# EAGLE design wxeda-sd-mod (EAGLE 7.0.0)
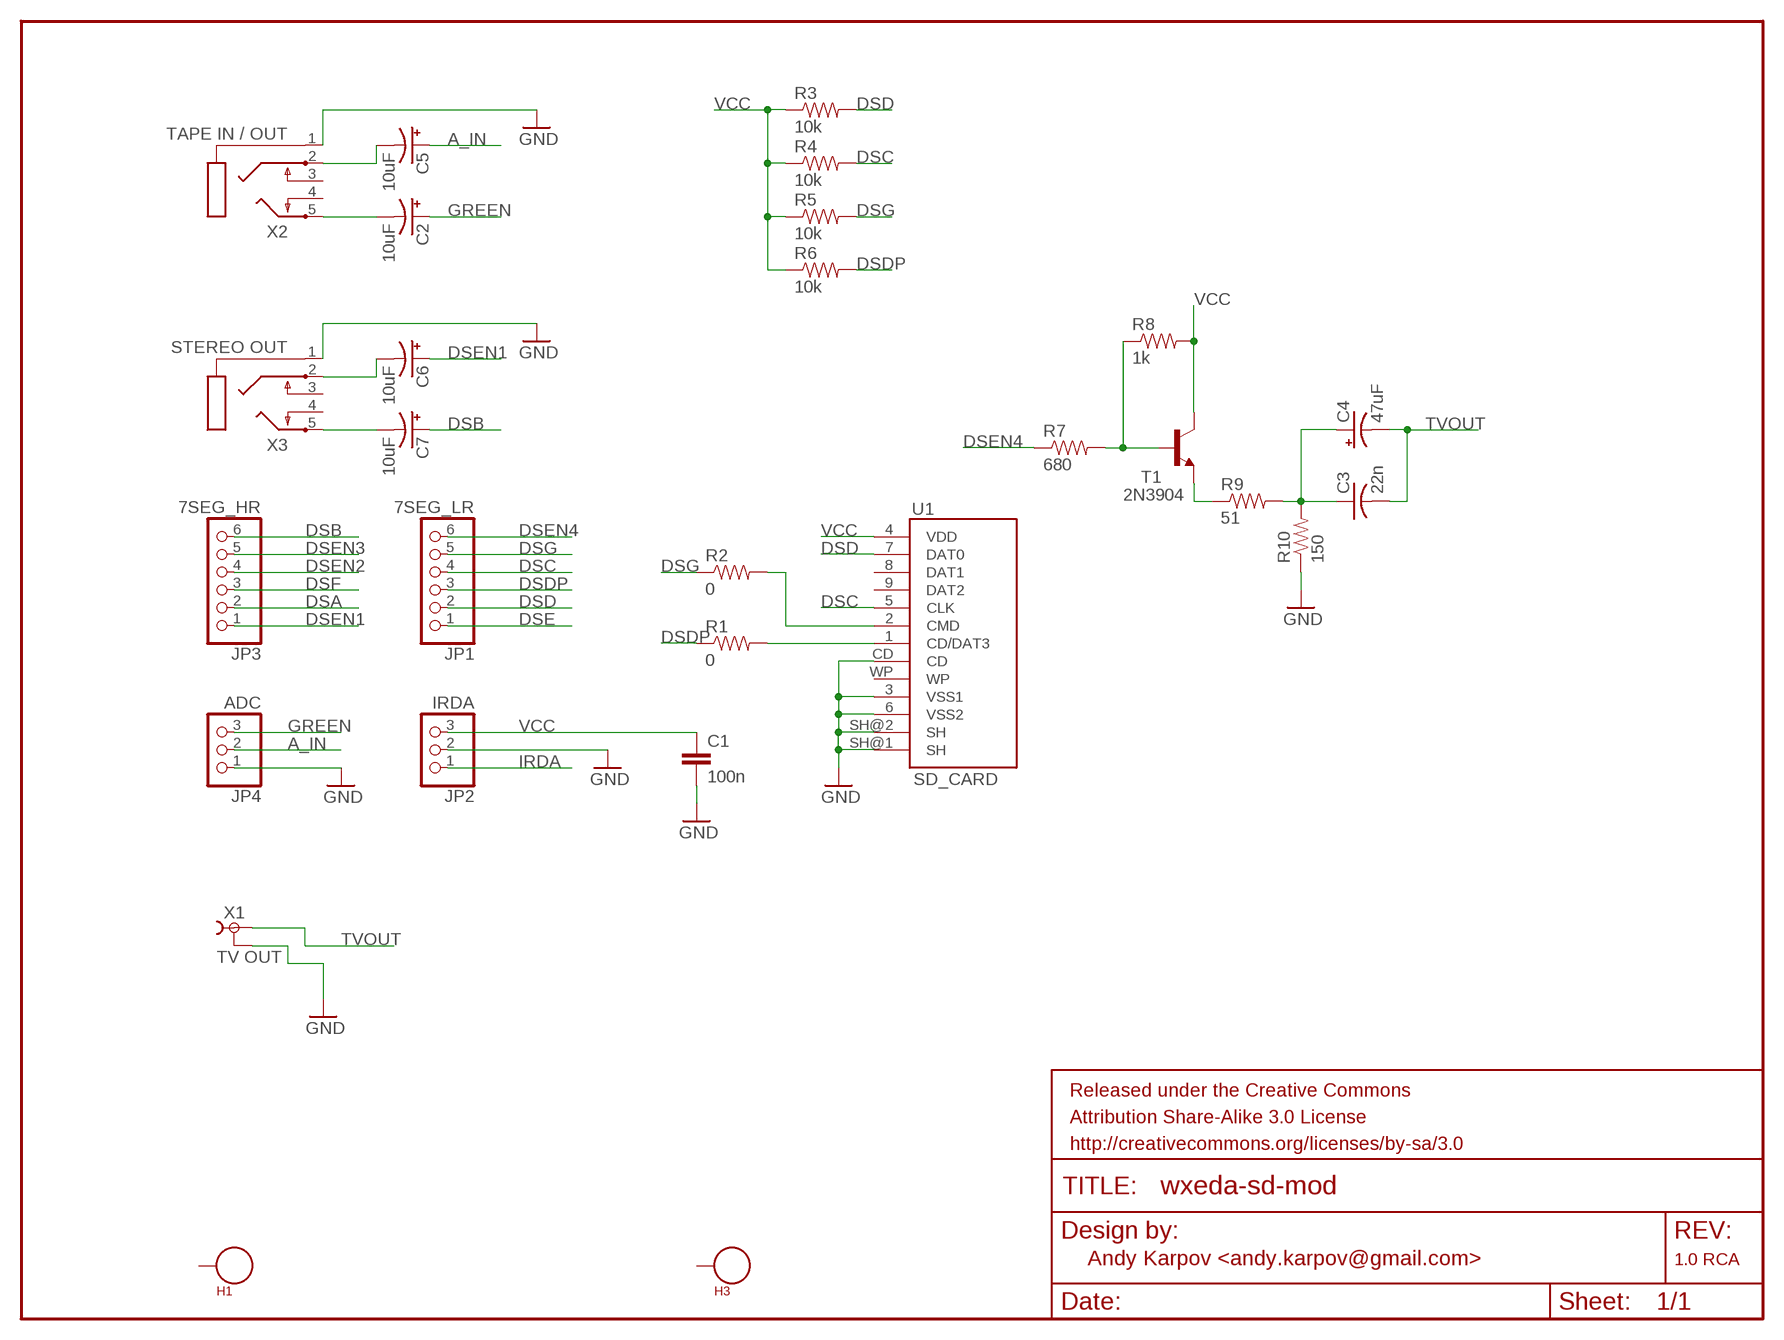
[diagram p0: schematic, sheet 1]

## Parts
C1  100n  CAP1206  [1206]
C2  10uF  CPOL-USE2,5-6E  [E2,5-6E]
C3  22n  C-US050-025X075  [C050-025X075]
C4  47uF  CPOL-USE2,5-6E  [E2,5-6E]
C5  10uF  CPOL-USE2,5-6E  [E2,5-6E]
C6  10uF  CPOL-USE2,5-6E  [E2,5-6E]
C7  10uF  CPOL-USE2,5-6E  [E2,5-6E]
FRAME1  FRAME-LETTER  [CREATIVE_COMMONS]
H1  SEW_HOLE  [SIMPLE_HOLE]
H3  SEW_HOLE  [SIMPLE_HOLE]
JP1  7SEG_LR  PINHD-1X6  [1X06]
JP2  IRDA  PINHD-1X3  [1X03]
JP3  7SEG_HR  PINHD-1X6  [1X06]
JP4  ADC  PINHD-1X3  [1X03]
R1  0  RESISTORAXIAL-0.3  [AXIAL-0.3]
R2  0  RESISTORAXIAL-0.3  [AXIAL-0.3]
R3  10k  RESISTORAXIAL-0.3  [AXIAL-0.3]
R4  10k  RESISTORAXIAL-0.3  [AXIAL-0.3]
R5  10k  RESISTORAXIAL-0.3  [AXIAL-0.3]
R6  10k  RESISTORAXIAL-0.3  [AXIAL-0.3]
R7  680  RESISTORAXIAL-0.3  [AXIAL-0.3]
R8  1k  RESISTORAXIAL-0.3  [AXIAL-0.3]
R9  51  RESISTORAXIAL-0.3  [AXIAL-0.3]
R10  150  RESISTORAXIAL-0.3  [AXIAL-0.3]
T1  2N3904  [TO92]
U1  SD_CARD  SD_CARD_SOCKET4UCON  [SDCARD_4UCONN]
X1  TV OUT  TOBU3  [TOBU3]
X2  TAPE IN / OUT  STEREOJACK  [STX3100]
X3  STEREO OUT  STEREOJACK  [STX3100]

## Nets
A_IN: C5.+ JP4.2
DSA: JP3.2
DSB: C7.+ JP3.6
DSC: JP1.4 R4.P$2 U1.5(CLK)
DSD: JP1.2 R3.P$2 U1.7(DAT0)
DSDP: JP1.3 R1.P$1 R6.P$2
DSE: JP1.1
DSEN1: C6.+ JP3.1
DSEN2: JP3.4
DSEN3: JP3.5
DSEN4: JP1.6 R7.P$1
DSF: JP3.3
DSG: JP1.5 R2.P$1 R5.P$2
GND: C1.2 JP2.2 JP4.1 R10.P$1 U1.3(VSS1) U1.6(VSS2) U1.CD U1.SH@1(SH) U1.SH@2(SH) X1.2 X1.2@1 X1.2@2 X2.1 X3.1
GREEN: C2.+ JP4.3
IRDA: JP2.1
N$1: R1.P$2 U1.1(CD/DAT3)
N$2: R7.P$2 R8.P$1 T1.2(B)
N$3: R2.P$2 U1.2(CMD)
N$4: C2.- X2.5
N$6: C5.- X2.2
N$7: R9.P$1 T1.3(E)
N$8: C3.1 C4.+ R9.P$2 R10.P$2
N$9: C6.- X3.2
N$11: C7.- X3.5
TVOUT: C3.2 C4.- X1.1
VCC: C1.1 JP2.3 R3.P$1 R4.P$1 R5.P$1 R6.P$1 R8.P$2 T1.1(C) U1.4(VDD)
Unconnected: H1.P$1 H3.P$1 U1.8(DAT1) U1.9(DAT2) U1.WP X2.3 X2.4 X3.3 X3.4

## Notes on the sheet
- Andy Karpov <andy.karpov@gmail.com> | 1.0 RCA

## Library data of the parts
C1 = SparkFun-Capacitors:CAP: Capacitor Standard 0603 ceramic capacitor, and 0.1" leaded capacitor.
C2 C4-C7 = adafruit:CPOL-US: POLARIZED CAPACITOR, American symbol
C3 = adafruit:C-US: CAPACITOR, American symbol
FRAME1 = SparkFun-Aesthetics:FRAME-LETTER: Schematic Frame Standard 8.5x11 US Letter frame
H1 H3 = LilyPad-Wearables:SEW_HOLE: Simple sew-hole .1" diameter hole with 20mil annular ring
JP1 JP3 = pinhead:PINHD-1X6: PIN HEADER
JP2 JP4 = pinhead:PINHD-1X3: PIN HEADER
R1-R10 = SparkFun-Passives:RESISTOR: Resistor Basic schematic elements and footprints for 0603, 1206, and PTH resistors.
T1 = transistor:2N3904: NPN TRANSISTOR
U1 = SparkFun-Connectors:SD_CARD_SOCKET: SD Memory Card Connector, push-push normal type, CD enable, WP enable
X1 = con-hirschmann:TOBU3: Female Cinch CONNECTOR ( RCA Jack ); MF: FARNELL; MPN: TOBU 3; OC_FARNELL: 592791; OC_NEWARK: 06WX5914
X2 X3 = adafruit:STEREOJACK: MIC/HEADPHONE JACK Stereo jack with two switches. Kycon STX3100, CUI SJ1-3555NG and/or 4UCon 05544

## Board
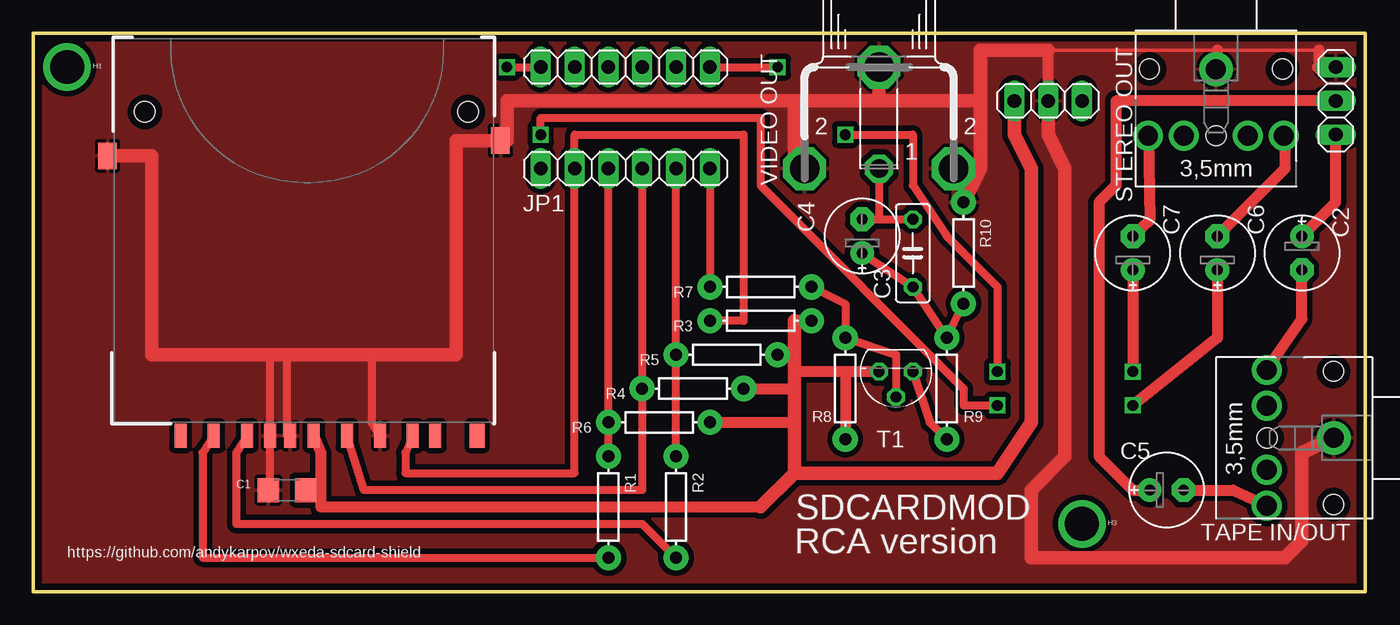
[diagram p1: board, top side]
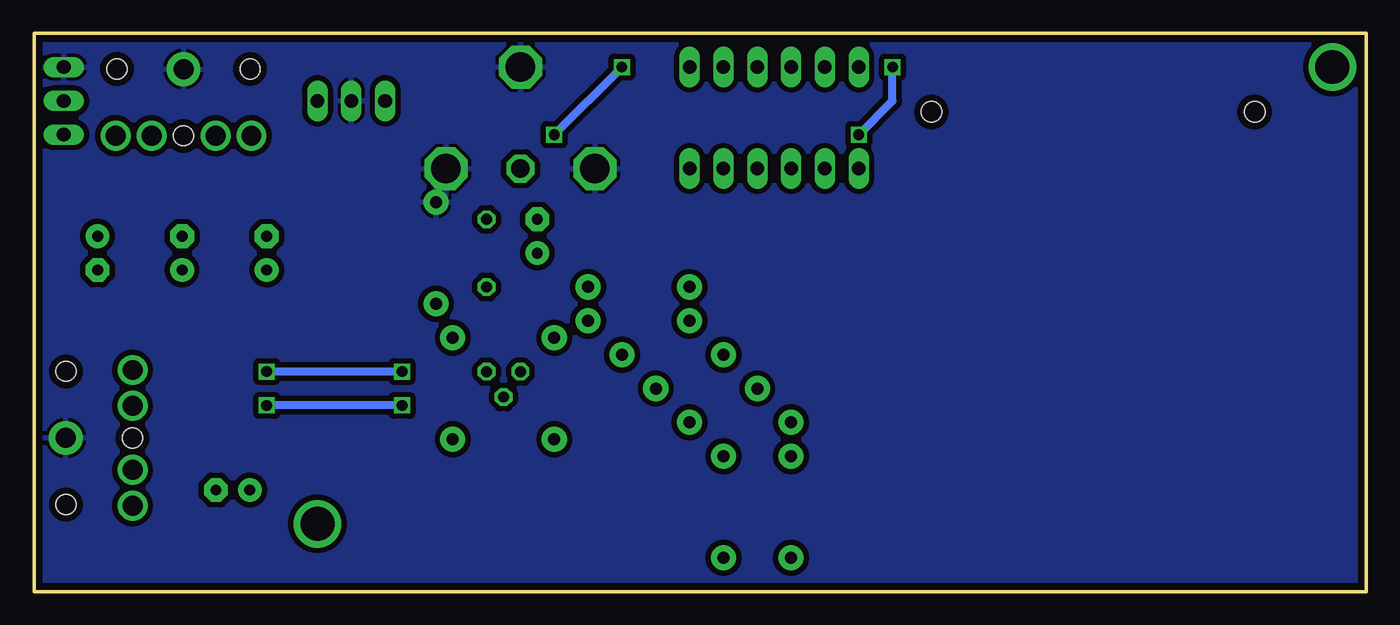
[diagram p2: board, bottom side, seen from below]

Size 100 x 41.9 mm. Coordinates in mm from the lower left corner, seen from the top.
Outline: 0,0 100,0 100,41.9 0,41.9 0,0
Copper layers (1*16): Top 0.035mm / dielectric 1.5mm / Bottom 0.035mm
Design rules "EagleRules": minimum track width 7mil, minimum drill 12mil, track to track 7mil, track to pad 7mil, pad to pad 7mil, via to via 7mil, smd to smd 0mil, copper to edge 20mil, drill to drill 10mil, minimum pad ring 10mil, minimum via ring 6mil, stop-mask expansion 2mil, vias tented up to drill 25mil, thermal gap 10mil

### Footprints (pad centres in the part's own frame; a part is rotated, then mirrored left to right if it is on the bottom)
1206 = smd 1.6 x 1.8: 1 -1.4,0; 2 1.4,0
E2,5-6E = drill 0.813 pad 1.778: + -1.27,0 | drill 0.813 pad 1.778 octagon: - 1.27,0
C050-025X075 = drill 0.813 octagon: 1 -2.54,0; 2 2.54,0
SIMPLE_HOLE = drill 2.54 pad 3.048: P$1 0,0
1X06 = drill 1.016 long: 1 -6.35,0; 2 -3.81,0; 3 -1.27,0; 4 1.27,0; 5 3.81,0; 6 6.35,0
1X03 = drill 1.016 long: 1 -2.54,0; 2 0,0; 3 2.54,0
AXIAL-0.3 = drill 0.9 pad 1.88: P$1 -3.81,0; P$2 3.81,0
TO92 = drill 0.813 octagon: 1 1.27,0; 2 0,1.905; 3 -1.27,0
SDCARD_4UCONN = smd 1.8 x 0.9: 1 -1,6.77; 2 -1,4.27; 3 -1,2.52; 4 -1,-0.73; 5 -1,-3.23; 6 -1,-5.73; 7 -1,-8.15; 8 -1,-9.85; 9 -1,9.27; CD -1,1.02 | smd 2 x 1.4: SH@1 20,14.75; SH@2 21.15,-14.75 | smd 1.8 x 1.1: WP -1,-13 | hole 1.55: 23.3,11.94; 23.3,-12.32
TOBU3 = drill 1.397 octagon: 1 0,-2.54 | drill 2.21 octagon: 2 5.588,-2.54; 2@1 -5.588,-2.54; 2@2 0,5.08
STX3100 = drill 1.5 pad 2.54: 1 2.7,-0.1 | drill 1.5: 2 7.7,5; 3 7.7,2.3; 4 7.7,-2.5; 5 7.7,-5.2 | hole 1.5: 2.7,4.9; 2.7,-5.1; 7.7,-0.1

### Placement (x,y rotation side)
C1  19.05,7.62 180 top
C2  95.25,25.4 270 top
C3  66.04,25.4 90 top
C4  62.23,26.67 90 top
C5  85.09,7.62 0 top
C6  88.9,25.4 90 top
C7  82.55,25.4 90 top
FRAME1  19.05,-10.16 0 top  (outside the outline)
H1  2.54,39.37 0 top
H3  78.74,5.08 0 top
JP1  44.45,31.75 0 top
JP2  76.2,36.83 180 top
JP3  44.45,39.37 0 top
JP4  97.79,36.83 270 top
R1  43.18,6.35 270 top
R2  48.26,6.35 270 top
R3  54.61,20.32 180 top
R4  49.53,15.24 180 top
R5  52.07,17.78 180 top
R6  46.99,12.7 180 top
R7  54.61,22.86 0 top
R8  60.96,15.24 270 top
R9  68.58,15.24 90 top
R10  69.85,25.4 270 top
T1  64.77,16.51 180 top
U1  20.32,12.7 90 top
X1  63.5,34.29 0 top
X2  100.33,11.43 180 top
X3  88.9,41.91 270 top

### Tracks (layer width: path | path; a pad name or v marks a point on that pad's centre or on a via)
A_IN
  Top 0.813: JP4.2 81.28,36.83 81.28,30.48 80.01,29.21 80.01,10.16 82.55,7.62 C5.+
DSB  (via drill 0.8)
  Top 0.61: JP3.6 v55.88,39.37 | v60.96,34.29 66.04,34.29 66.04,30.48 68.58,26.67 72.39,22.86 v72.39,16.51
  Top 0.813: C7.+ v82.55,16.51
  Bottom 0.61: v72.39,16.51 v82.55,16.51 | v60.96,34.29 v55.88,39.37
DSC
  Top 0.61: JP1.4 R4.P$2 45.72,7.62 24.82,7.62 U1.5
DSD
  Top 0.61: U1.7 27.94,10.43 27.94,8.89 40.64,8.89 JP1.2 40.64,34.29 53.34,34.29 53.34,20.32 R3.P$2
DSDP
  Top 0.61: R1.P$1 R6.P$2 JP1.3
DSEN1  (via drill 0.8)
  Top 0.61: v72.39,13.97 69.85,13.97 69.85,15.24 54.61,30.48 54.61,35.56 38.1,35.56 v38.1,34.29 | v35.56,39.37 JP3.1
  Top 0.813: C6.+ 88.9,19.05 v82.55,13.97
  Bottom 0.61: v72.39,13.97 v82.55,13.97 | v35.56,39.37 35.56,36.83 v38.1,34.29
DSEN4
  Top 0.61: JP1.6 R7.P$1
DSG
  Top 0.61: R2.P$1 R5.P$2 | R5.P$2 JP1.5 | R5.P$2 48.26,20.32
GND
  Top 0.254: 76.2,40.64 88.9,40.64 96.52,40.64
  Top 0.61: 17.78,17.78 17.78,11.7 U1.3 17.8,7.62 C1.2 | 25.4,17.78 25.4,12.7 26.05,11.43 U1.6 | U1.SH@2 35.56,33.85 | U1.CD 19.05,11.7 19.05,17.78
  Top 0.813: JP2.2 76.2,40.64 | 96.52,40.64 96.52,39.37 | X3.1 88.9,39.21 88.9,40.64
  Top 1.016: JP4.1 96.52,39.37 | 35.56,33.85 35.56,36.83 57.15,36.83 | 57.15,36.83 57.15,31.75 X1.2@1 | 71.12,36.83 71.12,40.64 76.2,40.64 | U1.SH@1 8.89,32.7 8.89,17.78 17.78,17.78 19.05,17.78 25.4,17.78 31.75,17.78 31.75,33.85 U1.SH@2 | X1.2 71.12,31.75 | 71.12,31.75 71.12,36.83 | 71.12,36.83 63.5,36.83 | 63.5,36.83 57.15,36.83 | X1.2@2 63.5,36.83 | 71.12,31.75 R10.P$1 | X2.1 95.25,10.42 95.25,3.81 93.98,2.54 74.93,2.54 74.93,7.62 77.47,10.16 77.47,31.75 76.2,34.29 JP2.2
  pour Top (isolate 0.406): 0,41.91 100.33,41.91 100.33,0 0,0
  pour Bottom (isolate 0.406): 0,41.91 100.33,41.91 100.33,0 0,0
GREEN
  Top 0.813: C2.+ 97.79,29.21 JP4.3
N$1
  Top 0.61: U1.1 12.7,10.43 12.7,2.54 R1.P$2
N$2
  Top 0.61: R7.P$2 60.96,21.59 R8.P$1 64.77,17.78 T1.2
N$3
  Top 0.61: U1.2 15.24,10.43 15.24,5.08 45.72,5.08 R2.P$2
N$4
  Top 0.813: X2.5 95.25,20.44 C2.-
N$6
  Top 0.813: C5.- 90.09,7.62 X2.2
N$7
  Top 0.61: T1.3 67.31,12.7 R9.P$1
N$8
  Top 0.61: R10.P$2 R9.P$2 C3.1 C4.+
N$9
  Top 0.813: X3.2 93.98,34.21 93.98,31.75 C6.-
N$11
  Top 0.813: X3.5 83.82,27.86 C7.-
TVOUT
  Top 0.61: C4.- 63.5,27.94 | 63.5,27.94 C3.2 | X1.1 63.5,27.94
VCC
  Top 0.61: C1.1 21.59,7.62
  Top 0.813: U1.4 21.59,10.43 21.59,7.62 21.59,6.35 54.61,6.35 | R3.P$1 57.15,20.32 | R5.P$1 57.15,17.78 | R4.P$1 57.15,15.24 | R6.P$1 57.15,12.7 | T1.1 60.96,16.51 | 60.96,16.51 R8.P$2 | 60.96,16.51 57.15,16.51
  Top 1.016: 54.61,6.35 57.15,8.89 | 57.15,8.89 57.15,12.7 57.15,15.24 57.15,16.51 57.15,17.78 57.15,20.32 | JP2.3 73.66,34.29 74.93,31.75 74.93,12.7 72.39,8.89 57.15,8.89

### Text on the board
tNames: VIDEO OUT | STEREO OUT | SDCARDMOD | RCA version | TAPE IN/OUT | https://github.com/andykarpov/wxeda-sdcard-shield